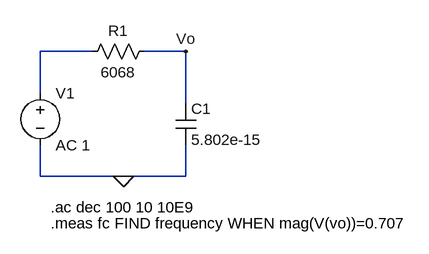
[diagram p0: schematic lpf.asc]
lpf.asc, the LTspice schematic file:
Version 4.1
SHEET 1 880 680
WIRE 176 48 96 48
WIRE 320 48 256 48
WIRE 96 112 96 48
WIRE 320 128 320 48
WIRE 96 240 96 192
WIRE 224 240 96 240
WIRE 320 240 320 192
WIRE 320 240 224 240
FLAG 224 240 0
FLAG 320 48 Vo
SYMBOL voltage 96 96 R0
SYMATTR InstName V1
SYMATTR Value AC 1
SYMBOL res 272 32 R90
WINDOW 0 0 56 VBottom 2
WINDOW 3 32 56 VTop 2
SYMATTR InstName R1
SYMATTR Value 6068
SYMBOL cap 304 128 R0
SYMATTR InstName C1
SYMATTR Value 5.802e-15
TEXT 112 288 Left 2 !.ac dec 100 10 10E9
TEXT 112 312 Left 2 !.meas fc FIND frequency WHEN mag(V(vo))=0.707

The netlist it stands for:
* lpf.asc
V1 N001 0 AC 1
R1 Vo N001 6068
C1 Vo 0 5.802e-15
.ac dec 100 10 10E9
.meas fc FIND frequency WHEN mag(V(vo))=0.707
.backanno
.end